# EAGLE design Motorschutz MC33926 (EAGLE 7.5.0)
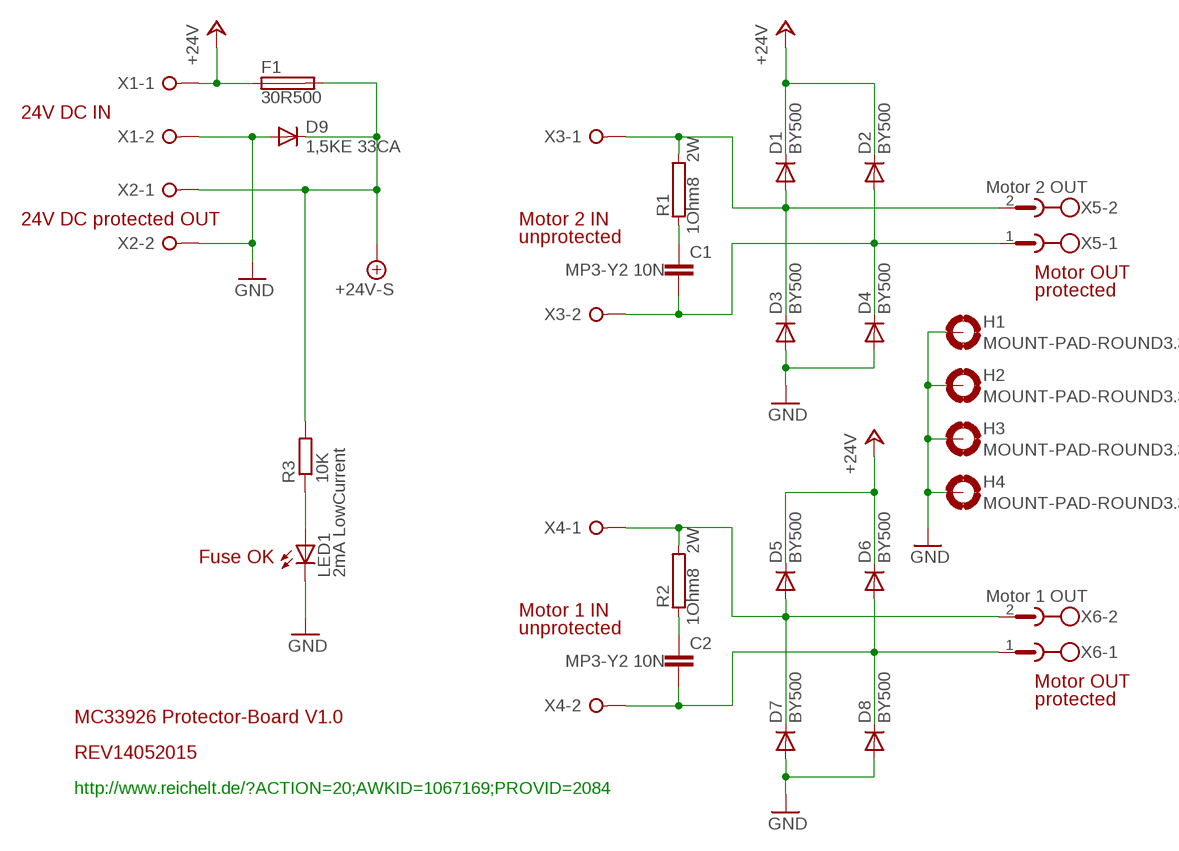
[diagram p0: schematic, sheet 1]

## Parts
C1  MP3-Y2 10N  C15/5  [C15B5]
C2  MP3-Y2 10N  C15/5  [C15B5]
D1  BY500  [DO201-15]
D2  BY500  [DO201-15]
D3  BY500  [DO201-15]
D4  BY500  [DO201-15]
D5  BY500  [DO201-15]
D6  BY500  [DO201-15]
D7  BY500  [DO201-15]
D8  BY500  [DO201-15]
D9  1,5KE 33CA  BY500  [DO201-15]
F1  30R500  LITTLEFUSE  [LITTLEFUSE]
H1  MOUNT-PAD-ROUND3.3  [3,3-PAD]
H2  MOUNT-PAD-ROUND3.3  [3,3-PAD]
H3  MOUNT-PAD-ROUND3.3  [3,3-PAD]
H4  MOUNT-PAD-ROUND3.3  [3,3-PAD]
LED1  2mA LowCurrent  LED5MM  [LED5MM]
R1  1Ohm8 2W  RAC07  [AC07]
R2  1Ohm8 2W  RAC07  [AC07]
R3  10K  R-EU_0204/7  [0204/7]
X1  W237-02P  [W237-132]
X2  W237-02P  [W237-132]
X3  W237-02P  [W237-132]
X4  W237-02P  [W237-132]
X5  Motor 2 OUT  MSTBV2  [MSTBV2]
X6  Motor 1 OUT  MSTBV2  [MSTBV2]

## Nets
+24V: D1.C D2.C D5.C D6.C F1.1 X1.1
+24V-S: D9.C F1.2 R3.2 X2.1
GND: D3.A D4.A D7.A D8.A D9.A H1.B3,3(MOUNT) H2.B3,3(MOUNT) H3.B3,3(MOUNT) H4.B3,3(MOUNT) LED1.K(C) X1.2 X2.2
N$1: D5.A D7.C R2.2 X4.1 X6.2
N$2: C2.1 R2.1
N$3: C2.2 D6.A D8.C X4.2 X6.1
N$4: D1.A D3.C R1.2 X3.1 X5.2
N$5: C1.2 D2.A D4.C X3.2 X5.1
N$6: C1.1 R1.1
N$10: LED1.A R3.1

## Notes on the sheet
- 24V DC IN
- 24V DC protected OUT | Motor 2 IN
- unprotected
- Motor OUT
- protected
- Fuse OK
- Motor 1 IN
- unprotected
- Motor OUT
- protected
- MC33926 Protector-Board V1.0
- REV14052015
- http://www.reichelt.de/?ACTION=20;AWKID=1067169;PROVID=2084

## Library data of the parts
C1 C2 = capacitor-wima:C: CAPACITOR naming: grid - package width
D1-D9 = diode:BY500: DIODE fast recovery diode, 5 A, 800 V
F1 = fuse:LITTLEFUSE: LITTLEFUSE Picofuse/slow Littlefuse; OC_FARNELL: unknown; OC_NEWARK: unknown
H1-H4 = holes:MOUNT-PAD-ROUND: MOUNTING PAD, round
LED1 = led:LED: LED OSRAM: - CHIPLED LG R971, LG N971, LY N971, LG Q971, LY Q971, LO R971, LY R971 LH N974, LH R974 LS Q976, LO Q976, LY Q976 LO Q996 - Hyper CHIPLED LW Q18S LB Q993, LB Q99A, LB R99A - SideLED LS A670, LO A670, LY A670, LG A670, LP A670 LB A673, LV A673, LT A673, LW A673 LH A674 LY A675 LS A676, LA A676, LO A676, LY A676, LW A676 LS A679, LY A679, LG A679 - Hyper Micro SIDELED® LS Y876, LA Y876, LO Y876, LY Y876 LT Y87S - SmartLED LW L88C, LW L88S LB L89C, LB L89S, LG L890 LS L89K, LO L89K, LY L89K LS L896, LA L896, LO L896, LY L896 - TOPLED LS T670, LO T670, LY T670, LG T670, LP T670 LSG T670, LSP T670, LSY T670, LOP T670, LYG T670 LG T671, LOG T671, LSG T671 LB T673, LV T673, LT T673, LW T673 LH T674 LS T676, LA T676, LO T676, LY T676, LB T676, LH T676, LSB T676, LW T676 LB T67C, LV T67C, LT T67C, LS T67K, LO T67K, LY T67K, LW E67C LS E67B, LA E67B, LO E67B, LY E67B, LB E67C, LV E67C, LT E67C LW T67C LS T679, LY T679, LG T679 LS T770, LO T770, LY T770, LG T770, LP T770 LB T773, LV T773, LT T773, LW T773 LH T774 LS E675, LA E675, LY E675, LS T675 LS T776, LA T776, LO T776, LY T776, LB T776 LHGB T686 LT T68C, LB T68C - Hyper Mini TOPLED® LB M676 - Mini TOPLED Santana® LG M470 LS M47K, LO M47K, LY M47K Source: http://www.osram.convergy.de LUXEON: - LUMILED® LXK2-PW12-R00, LXK2-PW12-S00, LXK2-PW14-U00, LXK2-PW14-V00 LXK2-PM12-R00, LXK2-PM12-S00, LXK2-PM14-U00 LXK2-PE12-Q00, LXK2-PE12-R00, LXK2-PE12-S00, LXK2-PE14-T00, LXK2-PE14-U00 LXK2-PB12-K00, LXK2-PB12-L00, LXK2-PB12-M00, LXK2-PB14-N00, LXK2-PB14-P00, LXK2-PB14-Q00 LXK2-PR12-L00, LXK2-PR12-M00, LXK2-PR14-Q00, LXK2-PR14-R00 LXK2-PD12-Q00, LXK2-PD12-R00, LXK2-PD12-S00 LXK2-PH12-R00, LXK2-PH12-S00 LXK2-PL12-P00, LXK2-PL12-Q00, LXK2-PL12-R00 Source: www.luxeon.com KINGBRIGHT: KA-3528ASYC Source: www.kingbright.com
R1 R2 = resistor-power:R: Power Resitor; OC_FARNELL: unknown; OC_NEWARK: unknown
R3 = resistor:R-EU_: RESISTOR, European symbol
X1-X4 = con-wago-508:W237-02P: WAGO SREW CLAMP; OC_FARNELL: unknown; OC_NEWARK: unknown
X5 X6 = con-phoenix-508:MSTBV2: PHOENIX; MPN: MSTBV 2,5/2-GF-5.08; OC_FARNELL: 1792792; OC_NEWARK: 69R9845

## Board
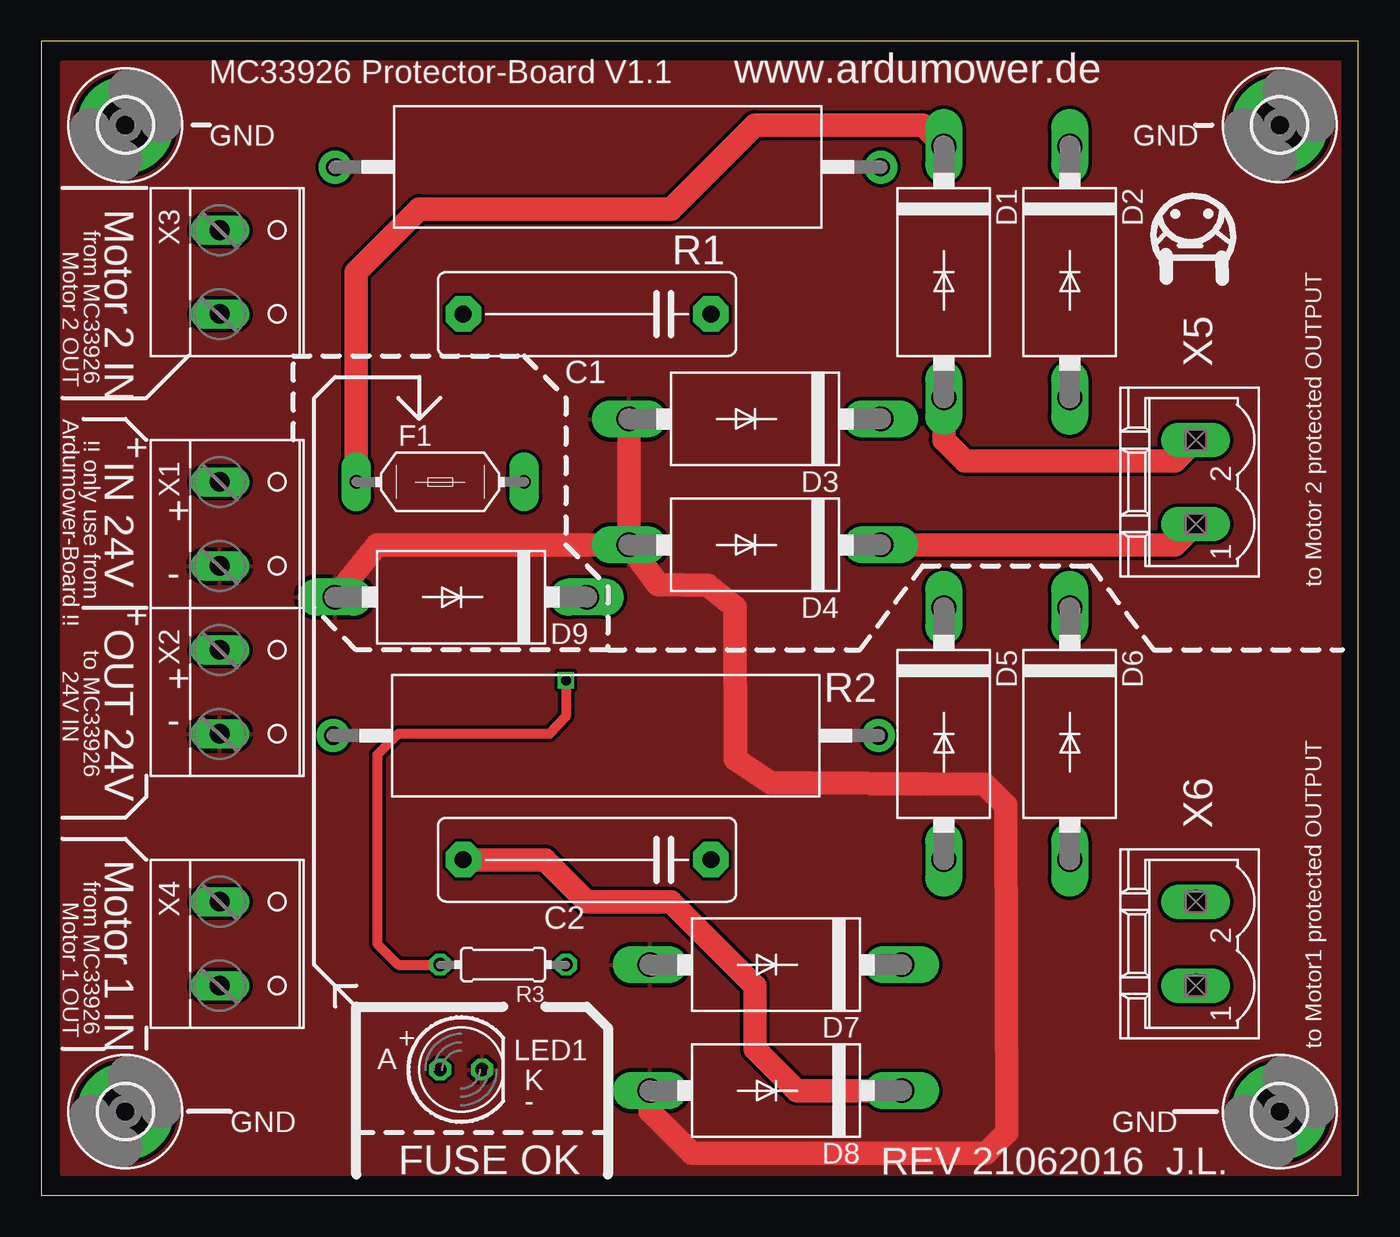
[diagram p1: board, top side]
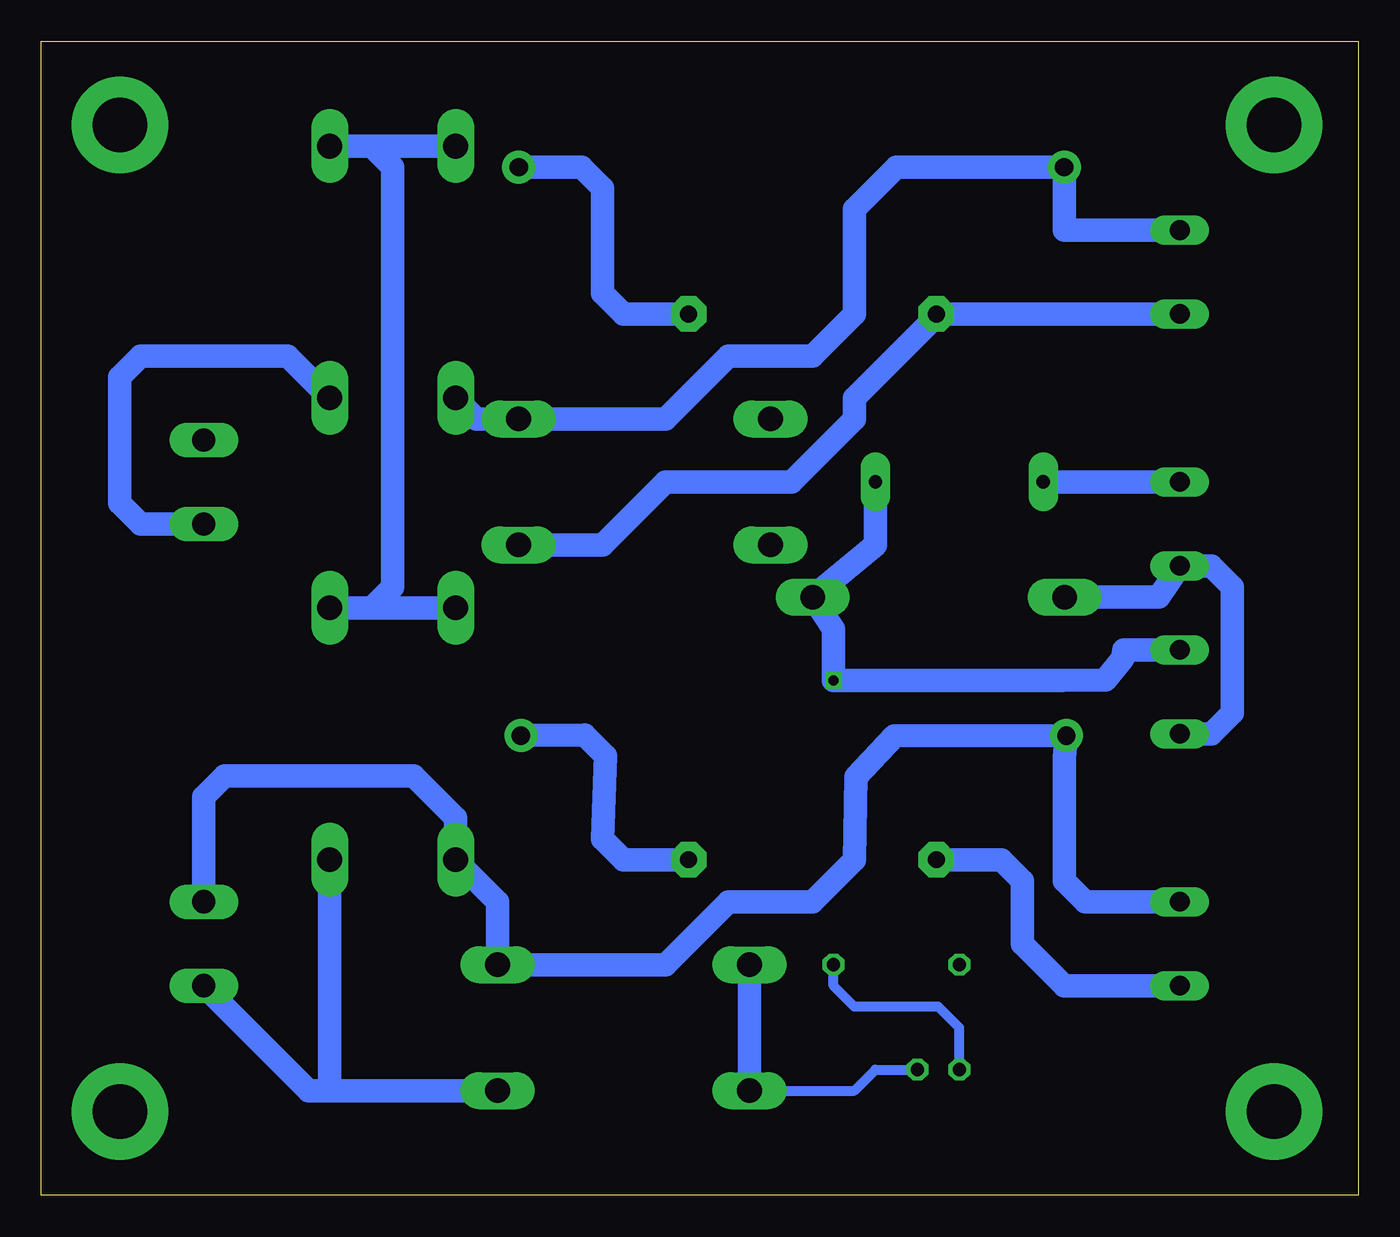
[diagram p2: board, bottom side, seen from below]

Size 79.68 x 69.84 mm. Coordinates in mm from the lower left corner, seen from the top.
Outline: 0,0 79.68,0 79.68,69.84 0,69.84 0,0
Copper layers (1*16): Top 0.035mm / dielectric 1.5mm / Bottom 0.035mm
Design rules "default": minimum track width 10mil, minimum drill 24mil, track to track 8mil, track to pad 8mil, pad to pad 8mil, via to via 8mil, smd to smd 8mil, copper to edge 40mil, drill to drill 8mil, minimum pad ring 10mil, minimum via ring 8mil, stop-mask expansion 4mil, vias tented up to drill 0mil, thermal gap 10mil

### Footprints (pad centres in the part's own frame; a part is rotated, then mirrored left to right if it is on the bottom)
C15B5 = drill 1.016 pad 2.159 octagon: 1 -7.493,0; 2 7.493,0
DO201-15 = drill 1.499 long: A 7.62,0; C -7.62,0
LITTLEFUSE = drill 0.813 pad 1.778 long: 1 -5.08,0; 2 5.08,0
3,3-PAD = drill 3.3 pad 5.842: B3,3 0,0
LED5MM = drill 0.813 octagon: A -1.27,0; K 1.27,0
AC07 = drill 1.1 pad 2: 1 -16.5,0; 2 16.5,0
0204/7 = drill 0.813 octagon: 1 -3.81,0; 2 3.81,0
W237-132 = drill 1.194 long: 1 -2.54,-0.635; 2 2.54,-0.635
MSTBV2 = drill 1.397 long: 1 -2.54,0; 2 2.54,0

### Placement (x,y rotation side)
C1  33.02,53.34 180 top
C2  33.02,20.32 180 top
D1  54.61,55.88 270 top
D2  62.23,55.88 270 top
D3  43.18,46.99 180 top
D4  43.18,39.37 180 top
D5  54.61,27.94 270 top
D6  62.23,27.94 270 top
D7  44.45,13.97 180 top
D8  44.45,6.35 180 top
D9  25.39,36.2 180 top
F1  24.13,43.18 0 top
H1  5.08,5.08 0 top
H2  5.08,64.77 0 top
H3  74.93,64.77 0 top
H4  74.93,5.08 0 top
LED1  25.4,7.62 0 top
R1  34.29,62.23 180 top
R2  34.16,27.83 180 top
R3  27.94,13.97 180 top
X1  11.43,40.64 270 top
X2  11.43,30.48 270 top
X3  11.43,55.88 270 top
X4  11.43,15.24 270 top
X5  69.85,43.18 90 top
X6  69.85,15.24 90 top

### Tracks (layer width: path | path; a pad name or v marks a point on that pad's centre or on a via)
+24V
  Top 1.422: F1.1 19.05,55.88 22.86,59.69 38.1,59.69 43.18,64.77 53.34,64.77 D1.C
  Bottom 1.422: D1.C 59.69,63.5 | 59.69,63.5 D2.C | D5.C D6.C 59.69,35.56 58.42,36.83 58.42,62.23 59.69,63.5 | X1.1 F1.1
+24V-S  (via drill 0.6)
  Top 0.61: v31.74,31.17 31.74,29 30.76,27.94 21.59,27.94 20.32,26.67 20.32,15.24 21.59,13.97 R3.2
  Bottom 1.422: F1.2 29.21,39.37 D9.C 31.75,34.29 v31.74,31.17 17.88,31.16 15.28,31.2 14.23,32.5 14.19,33.02 X2.1
GND
  Top 1.422: D9.A 20.32,39.37 D4.A | D4.A D3.A | D4.A 37.32,36.96 40.33,36.92 41.97,35.61 42.01,26.38 44.15,24.95 46.53,24.95 57.11,24.87 58.38,23.6 58.42,3.81 57.15,2.54 39.37,2.54 36.83,5.08 D8.A
  Bottom 0.61: D8.A 30.48,6.35 29.21,7.62 LED1.K
  Bottom 1.422: D9.A 12.06,36.2 X1.2 8.89,38.1 7.62,36.83 7.62,29.21 8.89,27.94 X2.2 | D8.A D7.A
  pour Top: 1.27,68.58 78.74,68.58 78.74,1.27 1.27,1.27
N$1
  Bottom 1.422: X4.1 16.51,17.78 17.78,19.05 17.78,26.52 R2.2 28.07,27.82 30.4,25.33 30.48,20.32 33.02,17.78 38.1,17.78 41.91,13.97 D7.C 52.07,17.78 D5.A 54.61,22.86 57.15,25.4 68.58,25.4 69.85,24.13 X6.2
N$2
  Bottom 1.422: C2.1 44.45,20.32 45.72,21.59 45.55,26.6 46.82,27.87 R2.1
N$3
  Top 1.422: D8.C 45.72,6.35 43.18,8.89 43.18,12.7 38.1,17.78 33.02,17.78 30.48,20.32 C2.2
  Bottom 1.422: X4.2 17.78,12.7 20.32,15.24 20.32,19.05 21.59,20.32 C2.2 | D8.C 62.23,6.35 | X6.1 63.5,6.35 62.23,6.35 | 62.23,6.35 D6.A
N$4
  Top 1.422: D1.A 54.61,45.72 55.88,44.45 68.58,44.45 X5.2
  Bottom 1.422: X3.1 17.79,58.42 R1.2 27.94,62.23 30.48,59.69 30.48,53.34 33.02,50.8 38.1,50.8 41.91,46.99 D3.C 53.34,46.99 D1.A
N$5
  Top 1.422: D4.C 68.58,39.37 X5.1
  Bottom 1.422: X3.2 C1.2 25.53,53.21 30.48,48.26 30.48,46.99 34.29,43.18 41.91,43.18 45.72,39.37 D4.C | X5.1 73.66,40.64 74.93,41.91 74.93,49.53 73.66,50.8 64.77,50.8 D2.A
N$6
  Bottom 1.422: C1.1 44.45,53.34 45.72,54.61 45.72,60.96 46.99,62.23 R1.1
N$10
  Bottom 0.61: LED1.A 24.13,10.16 25.4,11.43 30.48,11.43 31.75,12.7 R3.1

### Text on the board
tPlace: MC33926 Protector-Board V1.1 | www.ardumower.de | GND | GND | Motor 2 IN | from MC33926 | Motor 2 OUT | Ardumower-Board !! | !! only use from | IN 24V | + | + | - | to Motor 2 protected OUTPUT | OUT 24V | + | to MC33926 | 24V IN | + | - | Motor 1 IN | from MC33926 | Motor 1 OUT | + | to Motor1 protected OUTPUT | A | K | - | GND | GND | FUSE OK | REV 21062016 J.L.